# EAGLE design board (EAGLE 9.6.2)
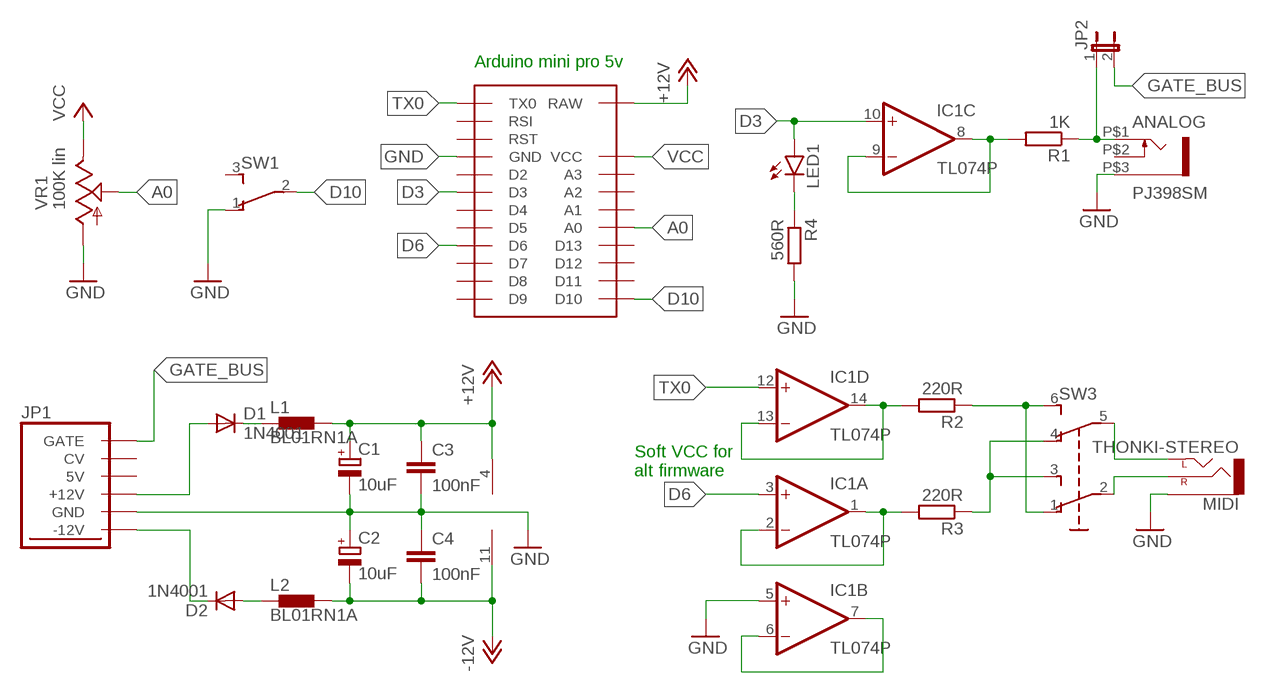
[diagram p0: schematic, sheet 1]

## Parts
ANALOG  PJ398SM  WQP-PJ301M-12_JACK  [WQP-PJ301M-12_JACK]
C1  10uF  CPOL-EUE2,5-6E  [E2,5-6E]
C2  10uF  CPOL-EUE2,5-6E  [E2,5-6E]
C3  100nF  C-EU025-024X044  [C025-024X044]
C4  100nF  C-EU025-024X044  [C025-024X044]
D1  1N4001  1N4004  [DO41-10]
D2  1N4001  1N4004  [DO41-10]
IC1  TL074P  [DIL14]
JP1  EUROPOWER16  [EUROPOWER16]
JP2  JP1E  [JP1]
JP3  ARDUINO_PRO_MINI_SOCKET  [ARDUINO_PRO_MINI_SOCKET]
L1  BL01RN1A  [BL01RN1A]
L2  BL01RN1A  [BL01RN1A]
LED1  LED3MM  [LED3MM]
MIDI  THONKI-STEREO  [WQP-PJ366ST_JACK]
R1  1K  R-EU_0204/5  [0204/5]
R2  220R  R-EU_0204/5  [0204/5]
R3  220R  R-EU_0204/5  [0204/5]
R4  560R  R-EU_0204/5  [0204/5]
SW1  SUB-MINI  TL36PO  [TL3XPO]
SW3  JS202011CQN  [JS202011CQN]
VR1  100K lin  9MM_SNAP-IN_POT_  [9MM_SNAP-IN_POT]

## Nets
+12V: C1.+ C3.1 IC1.4(P:V+) JP3.1(RAW) L1.2
-12V: C2.- C4.2 IC1.11(P:V-) L2.2
A0: JP3.8(A0) VR1.2(S)
CLOCK: ANALOG.P$1 JP2.1 R1.1
D3: IC1.10(C:+IN) JP3.18(D3) LED1.A
D6: IC1.3(A:+IN) JP3.21(D6)
D10: JP3.12(D10) SW1.2(P)
GATE_BUS: JP1.15(GATE) JP1.16(GATE) JP2.2
GND: ANALOG.P$3 C1.- C2.+ C3.2 C4.1 IC1.5(B:+IN) JP1.3(GND) JP1.4(GND) JP1.5(GND) JP1.6(GND) JP1.7(GND) JP1.8(GND) JP3.2(GND) JP3.16(GND) MIDI.P$3_SLEEVE(SLEEVE) R4.2 SW1.1(O) VR1.1(A)
N$1: D1.A JP1.9(+12V) JP1.10(+12V)
N$2: D2.C JP1.1(-12V) JP1.2(-12V)
N$3: D1.C L1.1
N$4: D2.A L2.1
N$5: IC1.1(A:OUT) IC1.2(A:-IN) R3.2
N$6: R2.1 SW3.1(A1) SW3.6(B2)
N$7: IC1.13(D:-IN) IC1.14(D:OUT) R2.2
N$8: LED1.K(C) R4.1
N$9: MIDI.P$1_TIP(LEFT) SW3.5(COM2)
N$10: MIDI.P$2_SWITCH(RIGHT) SW3.2(COM1)
N$11: R3.1 SW3.3(B1) SW3.4(A2)
N$12: IC1.6(B:-IN) IC1.7(B:OUT)
N$19: IC1.8(C:OUT) IC1.9(C:-IN) R1.2
TX0: IC1.12(D:+IN) JP3.13(TX0)
VCC: JP3.4(VCC) VR1.3(E)
Unconnected: ANALOG.P$2 JP1.11(5V) JP1.12(5V) JP1.13(CV) JP1.14(CV) JP3.3(RST) JP3.5(A3) JP3.6(A2) JP3.7(A1) JP3.9(D13) JP3.10(D12) JP3.11(D11) JP3.14(RSI) JP3.15(RST) JP3.17(D2) JP3.19(D4) JP3.20(D5) JP3.22(D7) JP3.23(D8) JP3.24(D9) SW1.3(S)

## Notes on the sheet
- Arduino mini pro 5v
- Soft VCC for
  alt firmware

## Library data of the parts
ANALOG = thonkiconn:WQP-PJ301M-12_JACK; OC_FARNELL: unknown
C1 C2 = rcl:CPOL-EU: POLARIZED CAPACITOR, European symbol; MF: NICHICON; MPN: UVR2A100MED1TD; OC_FARNELL: 1822773; SPICEPREFIX: C
C3 C4 = rcl:C-EU: CAPACITOR, European symbol; MF: MULTICOMP; MPN: MC0805Y104M500A2.54MM; OC_FARNELL: 2112751; SPICEPREFIX: C
D1 D2 = diode:1N4004: DIODE general purpose rectifier, 1 A; MF: VISHAY; MPN: 1N4001-E3/54; OC_FARNELL: 2889052
IC1 = linear:TL074: OP AMP; MF: TEXAS INSTRUMENTS; MPN: TL074BCN; OC_FARNELL: 3005122
JP1 = nagasaki45:EUROPOWER16: Eurorack 2x8 power connector; OC_FARNELL: unknown
JP2 = jumper:JP1E: JUMPER; MF: AMP - TE CONNECTIVITY; MPN: 826926-2; OC_FARNELL: 1248140
JP3 = nagasaki45:ARDUINO_PRO_MINI_SOCKET: Arduino pro mini socket; OC_FARNELL: unknown
L1 L2 = inductors:BL0: Noise Suppression Products/EMI Suppression Filters, Lead EMIFIL(R) Inductor Type Source: http://www.murata.com .. BL01RN1_DS.pdf; MF: MURATA; MPN: BL01RN1A1D2B; OC_FARNELL: 9526820
LED1 = led:LED: LED OSRAM: - CHIPLED LG R971, LG N971, LY N971, LG Q971, LY Q971, LO R971, LY R971 LH N974, LH R974 LS Q976, LO Q976, LY Q976 LO Q996 - Hyper CHIPLED LW Q18S LB Q993, LB Q99A, LB R99A - SideLED LS A670, LO A670, LY A670, LG A670, LP A670 LB A673, LV A673, LT A673, LW A673 LH A674 LY A675 LS A676, LA A676, LO A676, LY A676, LW A676 LS A679, LY A679, LG A679 - Hyper Micro SIDELED® LS Y876, LA Y876, LO Y876, LY Y876 LT Y87S - SmartLED LW L88C, LW L88S LB L89C, LB L89S, LG L890 LS L89K, LO L89K, LY L89K LS L896, LA L896, LO L896, LY L896 - TOPLED LS T670, LO T670, LY T670, LG T670, LP T670 LSG T670, LSP T670, LSY T670, LOP T670, LYG T670 LG T671, LOG T671, LSG T671 LB T673, LV T673, LT T673, LW T673 LH T674 LS T676, LA T676, LO T676, LY T676, LB T676, LH T676, LSB T676, LW T676 LB T67C, LV T67C, LT T67C, LS T67K, LO T67K, LY T67K, LW E67C LS E67B, LA E67B, LO E67B, LY E67B, LB E67C, LV E67C, LT E67C LW T67C LS T679, LY T679, LG T679 LS T770, LO T770, LY T770, LG T770, LP T770 LB T773, LV T773, LT T773, LW T773 LH T774 LS E675, LA E675, LY E675, LS T675 LS T776, LA T776, LO T776, LY T776, LB T776 LHGB T686 LT T68C, LB T68C - Hyper Mini TOPLED® LB M676 - Mini TOPLED Santana® LG M470 LS M47K, LO M47K, LY M47K Source: http://www.osram.convergy.de LUXEON: - LUMILED® LXK2-PW12-R00, LXK2-PW12-S00, LXK2-PW14-U00, LXK2-PW14-V00 LXK2-PM12-R00, LXK2-PM12-S00, LXK2-PM14-U00 LXK2-PE12-Q00, LXK2-PE12-R00, LXK2-PE12-S00, LXK2-PE14-T00, LXK2-PE14-U00 LXK2-PB12-K00, LXK2-PB12-L00, LXK2-PB12-M00, LXK2-PB14-N00, LXK2-PB14-P00, LXK2-PB14-Q00 LXK2-PR12-L00, LXK2-PR12-M00, LXK2-PR14-Q00, LXK2-PR14-R00 LXK2-PD12-Q00, LXK2-PD12-R00, LXK2-PD12-S00 LXK2-PH12-R00, LXK2-PH12-S00 LXK2-PL12-P00, LXK2-PL12-Q00, LXK2-PL12-R00 Source: www.luxeon.com KINGBRIGHT: KA-3528ASYC Source: www.kingbright.com; MF: BROADCOM; MPN: HLMP-1700; OC_FARNELL: 1003207
MIDI = MusicThingModular:THONKI-STEREO: 3.5mm socket for Eurorack modular synths; OC_FARNELL: unknown
R1 = rcl:R-EU_: RESISTOR, European symbol; MF: TE CONNECTIVITY; MPN: LR0204F1K0; OC_FARNELL: 2329885; SPICEPREFIX: R
R2-R4 = rcl:R-EU_: RESISTOR, European symbol; MF: TE CONNECTIVITY; MPN: LR0204F100K; OC_FARNELL: 2329853; SPICEPREFIX: R
SW1 = switch:TL36PO: TINY SWITCH ON - ON Source: http://www2.produktinfo.conrad.com/datenblaetter/700000-724999/705152-da-01-de-Subminiaturschalter_TL_36YO.pdf; OC_FARNELL: unknown
SW3 = switch-ck:JS202011: C&K Components JS Series Sub-Miniature DPDT Slide Switches; MF: C & K COMPONENTS; MPN: JS202011CQN; OC_FARNELL: 2320018
VR1 = MusicThingModular:9MM_SNAP-IN_POT: 9mm vertical snap-in pot, Alpha / Panasonic style; OC_FARNELL: unknown

## Board
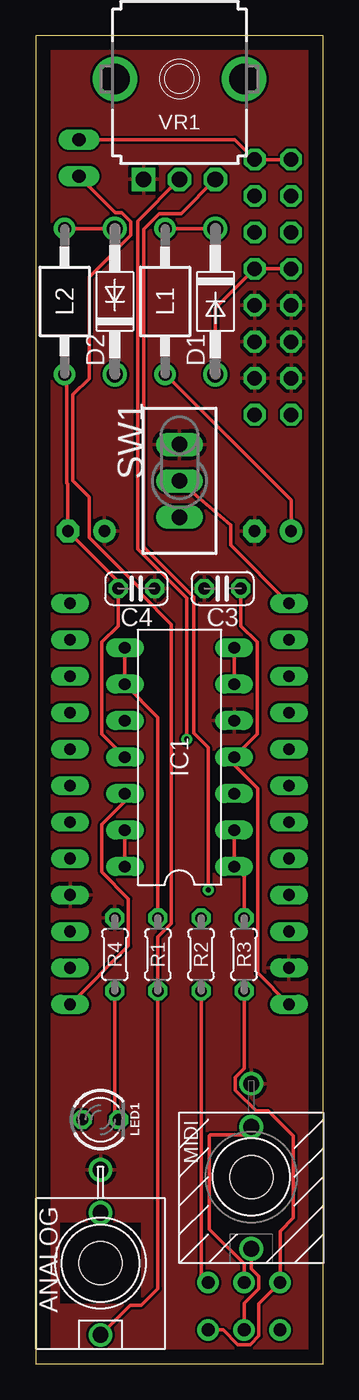
[diagram p1: board, top side]
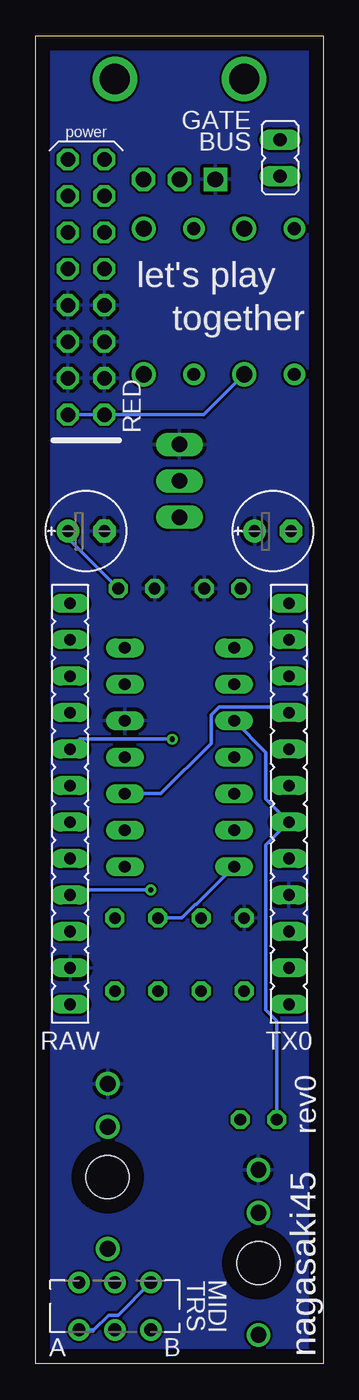
[diagram p2: board, bottom side, seen from below]

Size 20 x 92.5 mm. Coordinates in mm from the lower left corner, seen from the top.
Outline: 0,0 20,0 20,92.5 0,92.5 0,0
Copper layers (1*16): Top 0.035mm / dielectric 1.5mm / Bottom 0.035mm
Design rules "default": minimum track width 6mil, minimum drill 0.35mm, track to track 6mil, track to pad 6mil, pad to pad 6mil, via to via 6mil, smd to smd 6mil, copper to edge 40mil, drill to drill 6mil, minimum pad ring 10mil, minimum via ring 8mil, stop-mask expansion 4mil, vias tented up to drill 0mil, thermal gap 10mil
Holes 3 mm at 15,13 4.5,7

### Footprints (pad centres in the part's own frame; a part is rotated, then mirrored left to right if it is on the bottom)
WQP-PJ301M-12_JACK = drill 1.1: P$1 0,5; P$2 0,-3.5; P$3 0,-6.5
E2,5-6E = drill 0.813 pad 1.575: + -1.27,0 | drill 0.813 pad 1.575 octagon: - 1.27,0
C025-024X044 = drill 0.813 octagon: 1 -1.27,0; 2 1.27,0
DO41-10 = drill 1.118: A 5.08,0; C -5.08,0
DIL14 = drill 0.813 long: 1 -7.62,-3.81; 2 -5.08,-3.81; 3 -2.54,-3.81; 4 0,-3.81; 5 2.54,-3.81; 6 5.08,-3.81; 7 7.62,-3.81; 8 7.62,3.81; 9 5.08,3.81; 10 2.54,3.81; 11 0,3.81; 12 -2.54,3.81; 13 -5.08,3.81; 14 -7.62,3.81
EUROPOWER16 = drill 1.016 octagon: 1 -8.89,-1.27; 2 -8.89,1.27; 3 -6.35,-1.27; 4 -6.35,1.27; 5 -3.81,-1.27; 6 -3.81,1.27; 7 -1.27,-1.27; 8 -1.27,1.27; 9 1.27,-1.27; 10 1.27,1.27; 11 3.81,-1.27; 12 3.81,1.27; 13 6.35,-1.27; 14 6.35,1.27; 15 8.89,-1.27; 16 8.89,1.27
JP1 = drill 0.914 long: 1 0,-1.27; 2 0,1.27
ARDUINO_PRO_MINI_SOCKET = drill 0.813 long: 1 -13.97,7.62; 2 -11.43,7.62; 3 -8.89,7.62; 4 -6.35,7.62; 5 -3.81,7.62; 6 -1.27,7.62; 7 1.27,7.62; 8 3.81,7.62; 9 6.35,7.62; 10 8.89,7.62; 11 11.43,7.62; 12 13.97,7.62; 13 -13.97,-7.62; 14 -11.43,-7.62; 15 -8.89,-7.62; 16 -6.35,-7.62; 17 -3.81,-7.62; 18 -1.27,-7.62; 19 1.27,-7.62; 20 3.81,-7.62; 21 6.35,-7.62; 22 8.89,-7.62; 23 11.43,-7.62; 24 13.97,-7.62
BL01RN1A = drill 0.9 pad 1.5: 1 -5.08,0; 2 5.08,0
LED3MM = drill 0.813 octagon: A -1.27,0; K 1.27,0
WQP-PJ366ST_JACK = drill 1.1: P$1_TIP 0,5; P$2_SWITCH 0,-3.5; P$3_SLEEVE 0,-6.5
0204/5 = drill 0.813 octagon: 1 -2.54,0; 2 2.54,0
TL3XPO = drill 1.1 pad 1.422 long: 1 -2.54,0; 2 0,0; 3 2.54,0
JS202011CQN = drill 0.9 pad 1.5: 1 -2.5,-1.65; 2 0,-1.65; 3 2.5,-1.65; 4 -2.5,1.65; 5 0,1.65; 6 2.5,1.65
9MM_SNAP-IN_POT = drill 1.1 square: 1 -2.5,-7 | drill 1.1 octagon: 2 0,-7; 3 2.5,-7 | drill 2.1 pad 2.794: CHASSIS1 -4.5,0; CHASSIS2 4.5,0

### Placement (x,y rotation side)
ANALOG  4.5,7 180 top
C1  16.5,58 0 bottom
C2  3.5,58 0 bottom
C3  13,54 180 top
C4  7,54 180 top
D1  12.5,74 270 top
D2  5.5,74 90 top
IC1  10,42.25 90 top
JP1  16.5,75 90 bottom
JP2  3,84 0 bottom
JP3  10,39 90 bottom
L1  9,74 270 top
L2  2,74 270 top
LED1  4.5,17 0 top
MIDI  15,13 180 top
R1  8.5,28.5 90 top
R2  11.5,28.5 90 top
R3  14.5,28.5 90 top
R4  5.5,28.5 90 top
SW1  10,61.5 270 top
SW3  14.5,4 180 bottom
VR1  10,89.5 0 top

### Tracks (layer width: path | path; a pad name or v marks a point on that pad's centre or on a via)
+12V
  Top 0.254: C3.1 14.27,51.4 15.41,50.26 15.41,43.85 IC1.4 13.81,41.7 15.44,40.07 15.44,27.21 JP3.1 | C1.+ 17.77,60.15 L1.2
  Bottom 0.254: C3.1 17.77,57.5 C1.+
-12V
  Top 0.254: IC1.11 4.59,43.85 4.59,50.26 5.73,51.4 C4.2 5.73,54.5 C2.- 2.23,61.27 2.16,61.33 2.16,68.76 L2.2
A0  (via drill 0.35)
  Top 0.254: VR1.2 7.09,79.59 7.09,56.73 10.5,53.33 v10.5,43.5
  Bottom 0.254: JP3.8 16.93,43.5 v10.5,43.5
CLOCK
  Top 0.254: JP2.1 5.53,80.2 5.96,80.2 6.62,79.54 6.62,78.62 3.7,75.7 3.7,68.63 2.57,67.5 2.57,61.5 3.7,60.37 3.7,57.56 7.33,53.93 7.33,53.61 9.44,51.5 9.44,30.65 8.5,29.71 R1.1 8.5,5.22 7.35,4.07 6.57,4.07 ANALOG.P$1
D3
  Bottom 0.254: IC1.10 3.98,42.58 3.98,39.33 JP3.18 3.98,36.13 3.98,24.64 3.23,23.89 LED1.A
D6
  Bottom 0.254: IC1.3 11.29,39.71 7.79,43.21 7.79,45.18 7.24,45.73 2.76,45.73 JP3.21
D10
  Top 0.254: SW1.2 13.57,58.43 13.57,57.02 JP3.12
GATE_BUS
  Top 0.254: JP2.2 13.85,85.27 JP1.15 JP1.16
GND
  pour Top: -1,-1 -1,93.5 21,93.5 21,-1
  pour Bottom: -1,-1 21,-1 21,93.5 -1,93.5
N$1
  Top 0.254: JP1.10 JP1.9 12.5,73.54 D1.A
N$2
  Bottom 0.254: JP1.2 JP1.1 8.31,66.11 D2.C
N$3
  Top 0.254: D1.C L1.1
N$4
  Top 0.254: D2.A L2.1
N$5
  Top 0.254: IC1.2 IC1.1 14.5,33.94 R3.2
N$6
  Top 0.254: R2.1 11.5,6.15 SW3.1
  Bottom 0.254: SW3.1 14.27,3.38 14.93,3.38 15.96,2.35 SW3.6
N$7
  Top 0.254: IC1.14 IC1.13
  Bottom 0.254: IC1.14 8.84,31.98 8.89,31.98 9.83,31.04 R2.2
N$8
  Top 0.254: R4.1 5.5,17.27 LED1.K
N$9
  Top 0.254: SW3.5 14.5,4.19 15.53,5.22 15.53,6.08 15,6.61 MIDI.P$1_TIP
N$10
  Top 0.254: SW3.2 14.5,6.94 12.07,9.37 12.07,15.85 12.15,15.93 14.43,15.93 MIDI.P$2_SWITCH
N$11
  Top 0.254: R3.1 14.5,20.56 13.9,19.96 13.9,19.04 15.33,17.6 16.18,17.6 17.93,15.85 17.93,10.15 17,9.22 SW3.3 15.53,4.18 15.53,1.92 14.93,1.32 14.07,1.32 13.04,2.35 SW3.4
N$12
  Top 0.254: IC1.7 IC1.6
N$19
  Top 0.254: IC1.8 IC1.9 8.5,45.02 R1.2
TX0
  Top 0.254: IC1.12 6.19,39.16 4.59,37.56 4.59,34.24 6.44,32.39 6.44,29.09 JP3.13
VCC  (via drill 0.35)
  Top 0.254: VR1.3 10.11,80.11 8.57,80.11 7.5,79.04 7.5,56.9 11,53.4 11,43.93 12,42.93 v12,33
  Bottom 0.254: v12,33 17.27,33 JP3.4

### Text on the board
bPlace: GATE | BUS | let's play | together | rev0 | MIDI | TRS | nagasaki45 | B | A